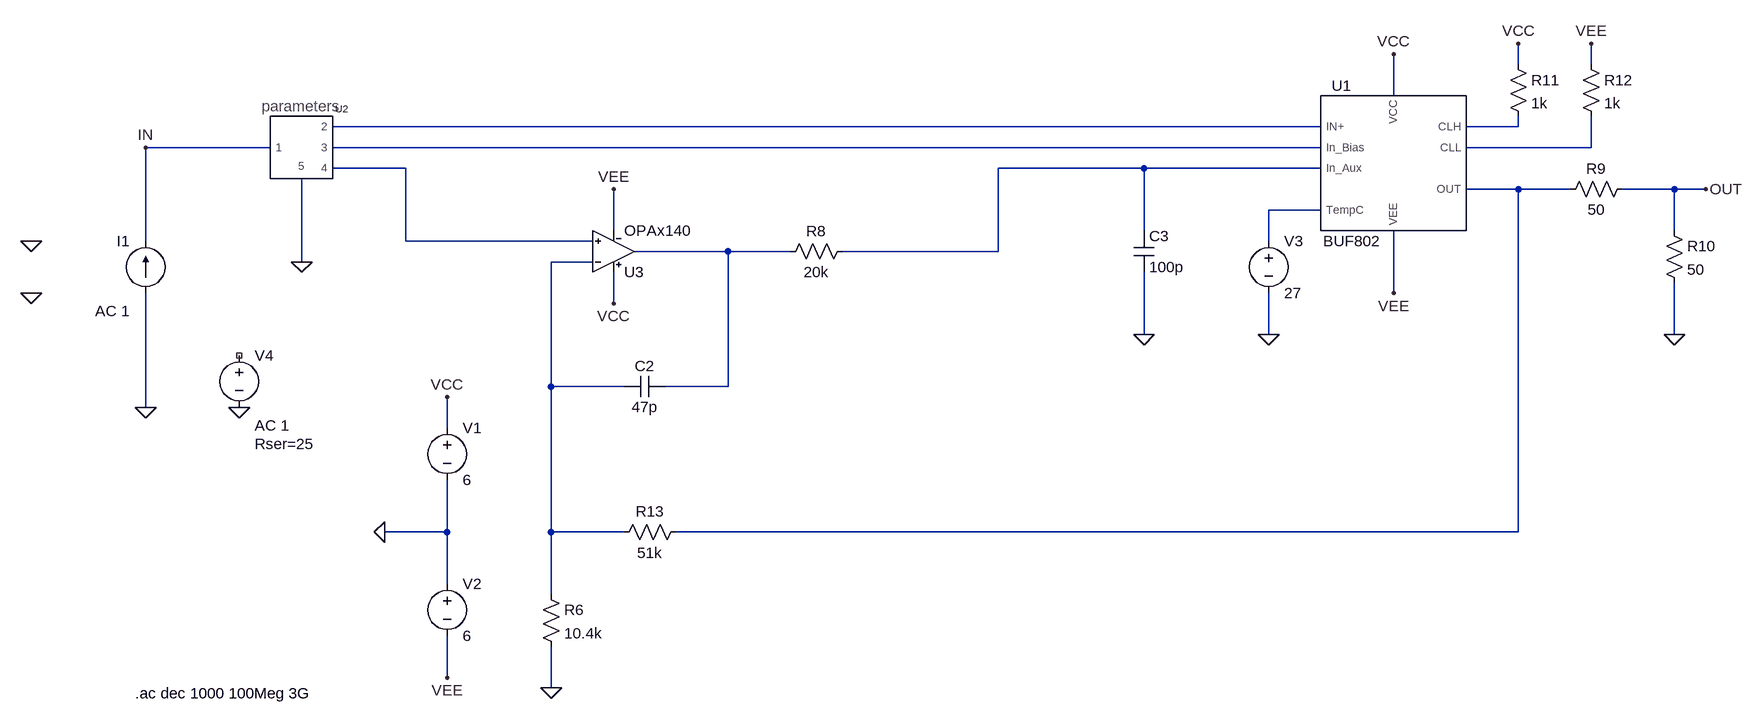
[diagram p0: schematic buf802-active-probe-sparam.asc]
buf802-active-probe-sparam.asc, the LTspice schematic file:
Version 4
SHEET 1 2532 1400
WIRE 1504 32 1504 0
WIRE 1616 32 1616 0
WIRE 1312 80 1312 16
WIRE 1200 128 -320 128
WIRE 1504 128 1504 112
WIRE 1504 128 1424 128
WIRE -416 160 -608 160
WIRE 1200 160 -320 160
WIRE 1616 160 1616 112
WIRE 1616 160 1424 160
WIRE -208 192 -320 192
WIRE 928 192 704 192
WIRE 1200 192 928 192
WIRE 1504 224 1424 224
WIRE 1584 224 1504 224
WIRE 1744 224 1664 224
WIRE 1792 224 1744 224
WIRE 1200 256 1120 256
WIRE 112 288 112 224
WIRE 928 288 928 192
WIRE 1744 288 1744 224
WIRE -608 304 -608 160
WIRE -208 304 -208 192
WIRE 80 304 -208 304
WIRE 1120 304 1120 256
WIRE 288 320 144 320
WIRE 384 320 288 320
WIRE 704 320 704 192
WIRE 704 320 464 320
WIRE -368 336 -368 208
WIRE 80 336 16 336
WIRE 1312 384 1312 288
WIRE 112 400 112 352
WIRE 928 448 928 352
WIRE 1120 448 1120 384
WIRE 1744 448 1744 368
WIRE 16 528 16 336
WIRE 128 528 16 528
WIRE 288 528 288 320
WIRE 288 528 192 528
WIRE -608 560 -608 384
WIRE -144 592 -144 544
WIRE -144 752 -144 672
WIRE -144 752 -240 752
WIRE 16 752 16 528
WIRE 128 752 16 752
WIRE 1504 752 1504 224
WIRE 1504 752 208 752
WIRE -144 832 -144 752
WIRE 16 848 16 752
WIRE -144 976 -144 912
WIRE 16 992 16 928
FLAG -240 752 0
FLAG 1120 448 0
FLAG -144 544 VCC
FLAG -144 976 VEE
FLAG 1312 384 VEE
FLAG 1312 16 VCC
FLAG 1504 0 VCC
FLAG 1616 0 VEE
FLAG 112 400 VCC
FLAG 112 224 VEE
FLAG 16 992 0
FLAG 928 448 0
FLAG 1744 448 0
FLAG -608 560 0
FLAG 1792 224 OUT
FLAG -368 336 0
FLAG -784 384 0
FLAG -784 304 0
FLAG -464 560 0
FLAG -608 160 IN
SYMBOL voltage -144 576 R0
WINDOW 123 0 0 Left 0
WINDOW 39 0 0 Left 0
SYMATTR InstName V1
SYMATTR Value 6
SYMBOL voltage 1120 288 R0
WINDOW 123 0 0 Left 0
WINDOW 39 0 0 Left 0
SYMATTR InstName V3
SYMATTR Value 27
SYMBOL cap 192 512 R90
WINDOW 0 0 32 VBottom 2
WINDOW 3 32 32 VTop 2
SYMATTR InstName C2
SYMATTR Value 47p
SYMBOL res 0 832 R0
SYMATTR InstName R6
SYMATTR Value 10.4k
SYMBOL res 368 336 R270
WINDOW 0 32 56 VTop 2
WINDOW 3 0 56 VBottom 2
SYMATTR InstName R8
SYMATTR Value 20k
SYMBOL cap 912 288 R0
SYMATTR InstName C3
SYMATTR Value 100p
SYMBOL res 1568 240 R270
WINDOW 0 32 56 VTop 2
WINDOW 3 0 56 VBottom 2
SYMATTR InstName R9
SYMATTR Value 50
SYMBOL res 1728 272 R0
SYMATTR InstName R10
SYMATTR Value 50
SYMBOL voltage -464 464 R0
WINDOW 123 24 124 Left 2
WINDOW 39 24 152 Left 2
SYMATTR Value2 AC 1
SYMATTR SpiceLine Rser=25
SYMATTR InstName V4
SYMATTR Value ""
SYMBOL res 1488 16 R0
SYMATTR InstName R11
SYMATTR Value 1k
SYMBOL res 1600 16 R0
SYMATTR InstName R12
SYMATTR Value 1k
SYMBOL res 224 736 R90
WINDOW 0 0 56 VBottom 2
WINDOW 3 32 56 VTop 2
SYMATTR InstName R13
SYMATTR Value 51k
SYMBOL BUF802 1296 176 R0
SYMATTR InstName U1
SYMBOL OPAx140 112 320 M180
SYMATTR InstName U3
SYMBOL voltage -144 816 R0
WINDOW 123 0 0 Left 0
WINDOW 39 0 0 Left 0
SYMATTR InstName V2
SYMATTR Value 6
SYMBOL current -608 384 R180
WINDOW 0 24 80 Left 2
WINDOW 3 24 0 Left 2
WINDOW 123 24 -28 Left 2
WINDOW 39 0 0 Left 0
SYMATTR InstName I1
SYMATTR Value ""
SYMATTR Value2 AC 1
SYMBOL parameters -368 144 R0
SYMATTR InstName U2
TEXT -624 1000 Left 2 !.ac dec 1000 100Meg 3G

The netlist it stands for:
* buf802-active-probe-sparam.asc
V1 VCC 0 6
V3 N008 0 27
C2 N009 N010 47p
R6 N010 0 10.4k
R8 N009 N006 20k
C3 N006 0 100p
R9 N007 OUT 50
R10 OUT 0 50
V4 NC_01 0 AC 1 Rser=25
R11 VCC N002 1k
R12 VEE N004 1k
R13 N007 N010 51k
XU1 N001 N007 VCC VEE N002 N004 N003 N006 N008 BUF802  ; pins IN+ OUT VCC VEE CLH CLL In_Bias In_Aux TempC
XU3 N005 N010 VCC VEE N009 OPAx140  ; pins In+ In- V+ V- OUT
V2 0 VEE 6
I1 0 IN AC 1
XU2 IN N001 N003 N005 0 parameters  ; pins 1 2 3 4 5
.ac dec 1000 100Meg 3G
.lib buf802.lib
.lib OPAx140.LIB
.lib parameters.inc
.backanno
.end